# EAGLE board Test (EAGLE 7.3.0)
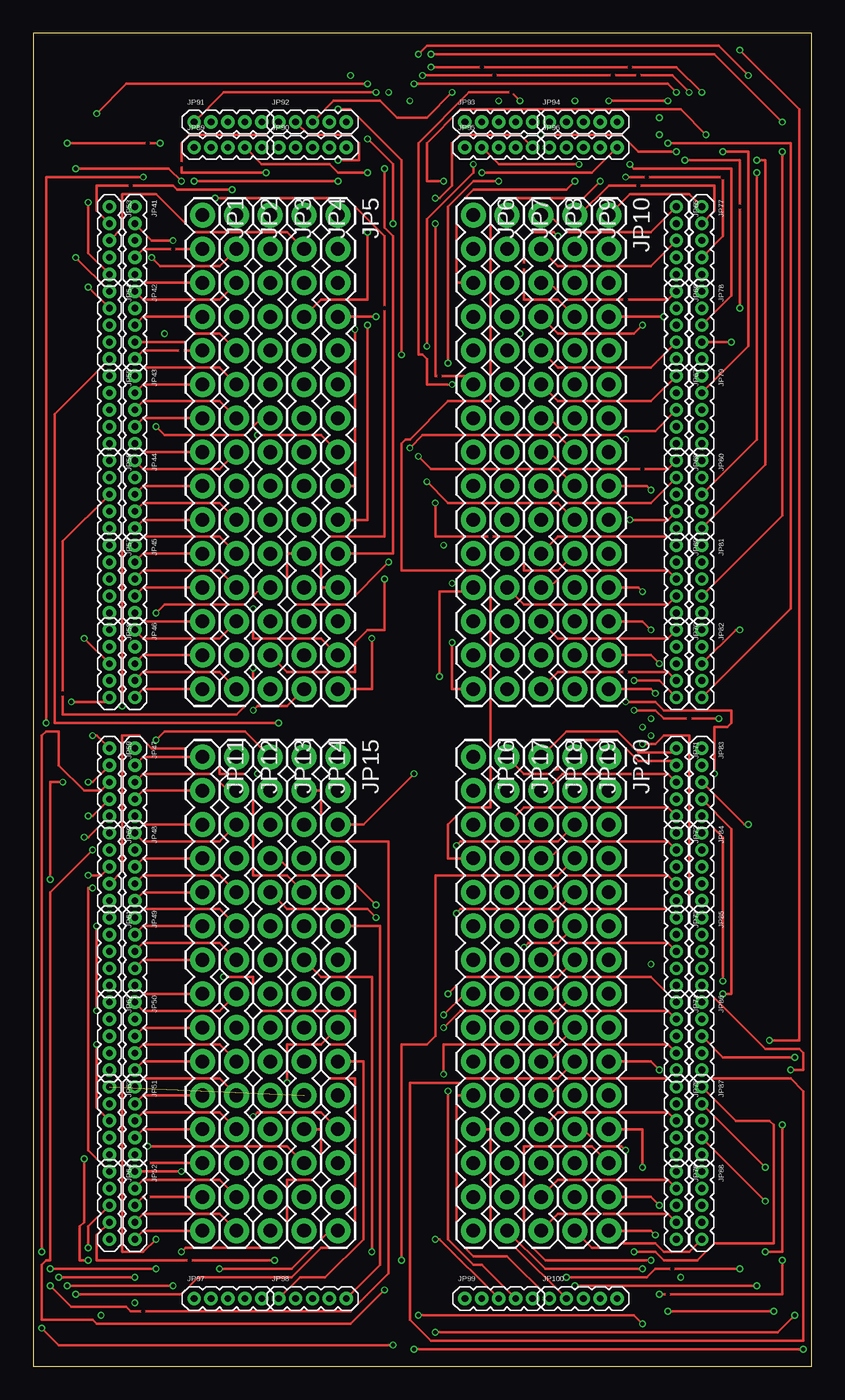
[diagram p2: board, top side]
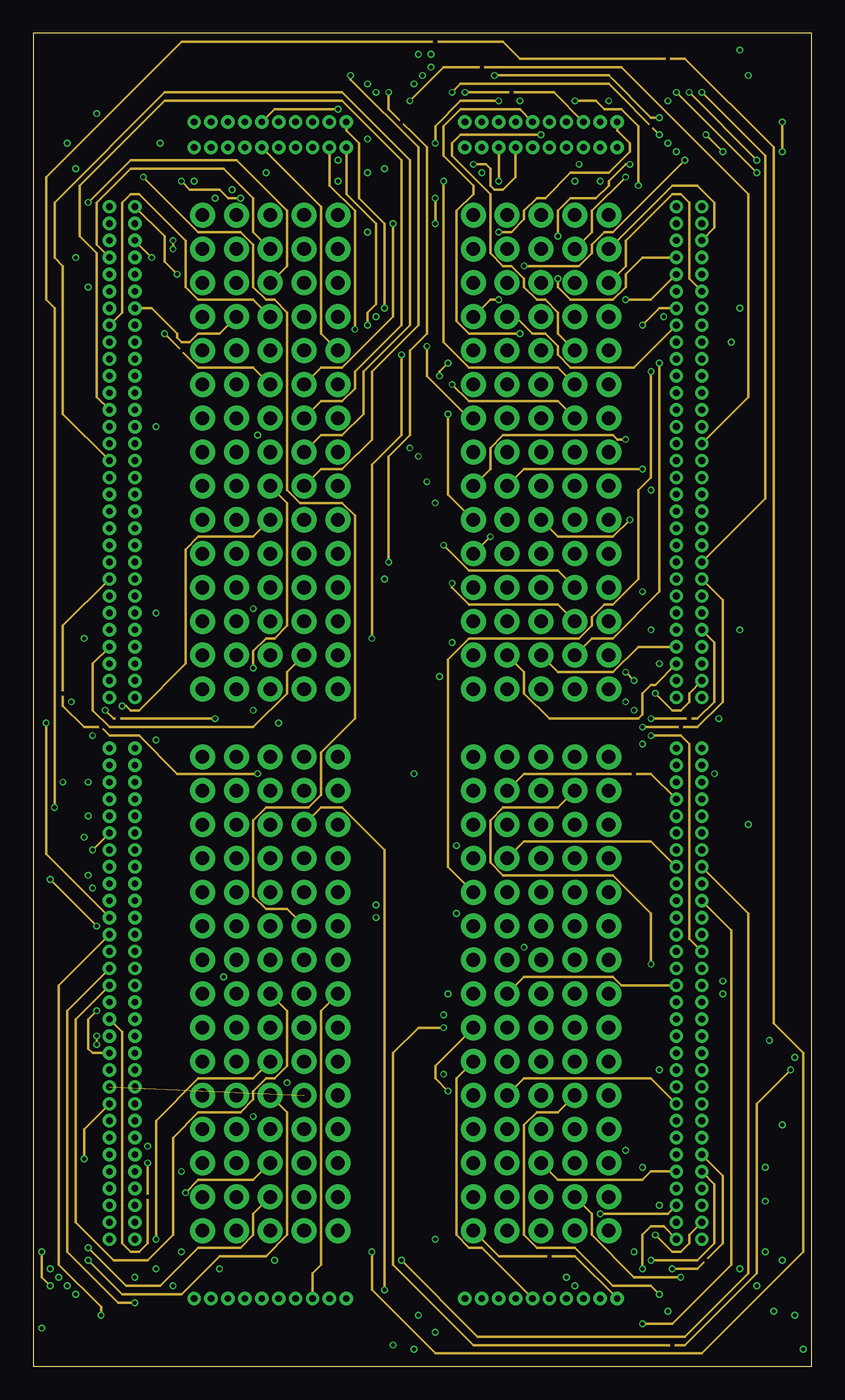
[diagram p3: board, inner layer Route2]
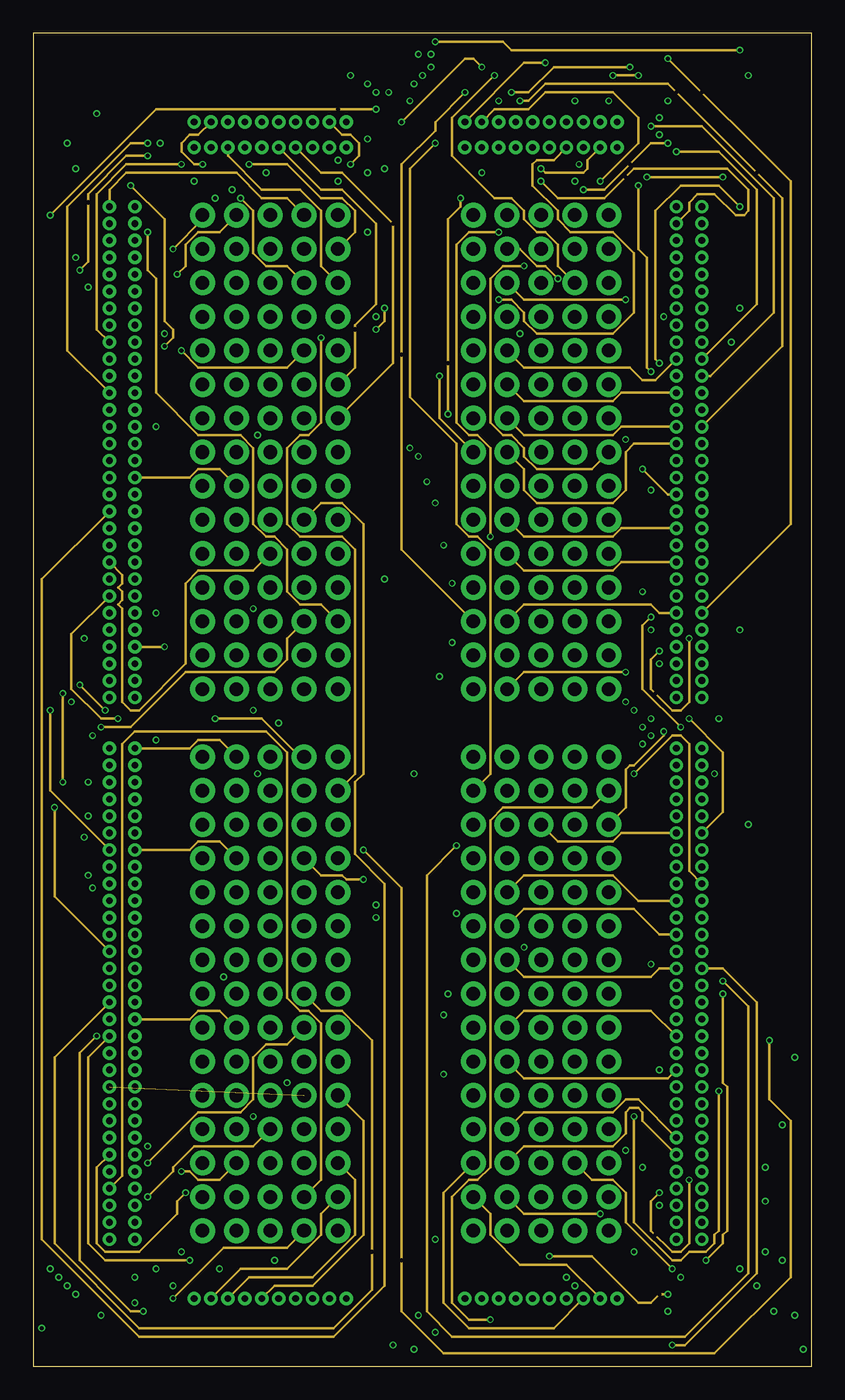
[diagram p4: board, inner layer Route15]
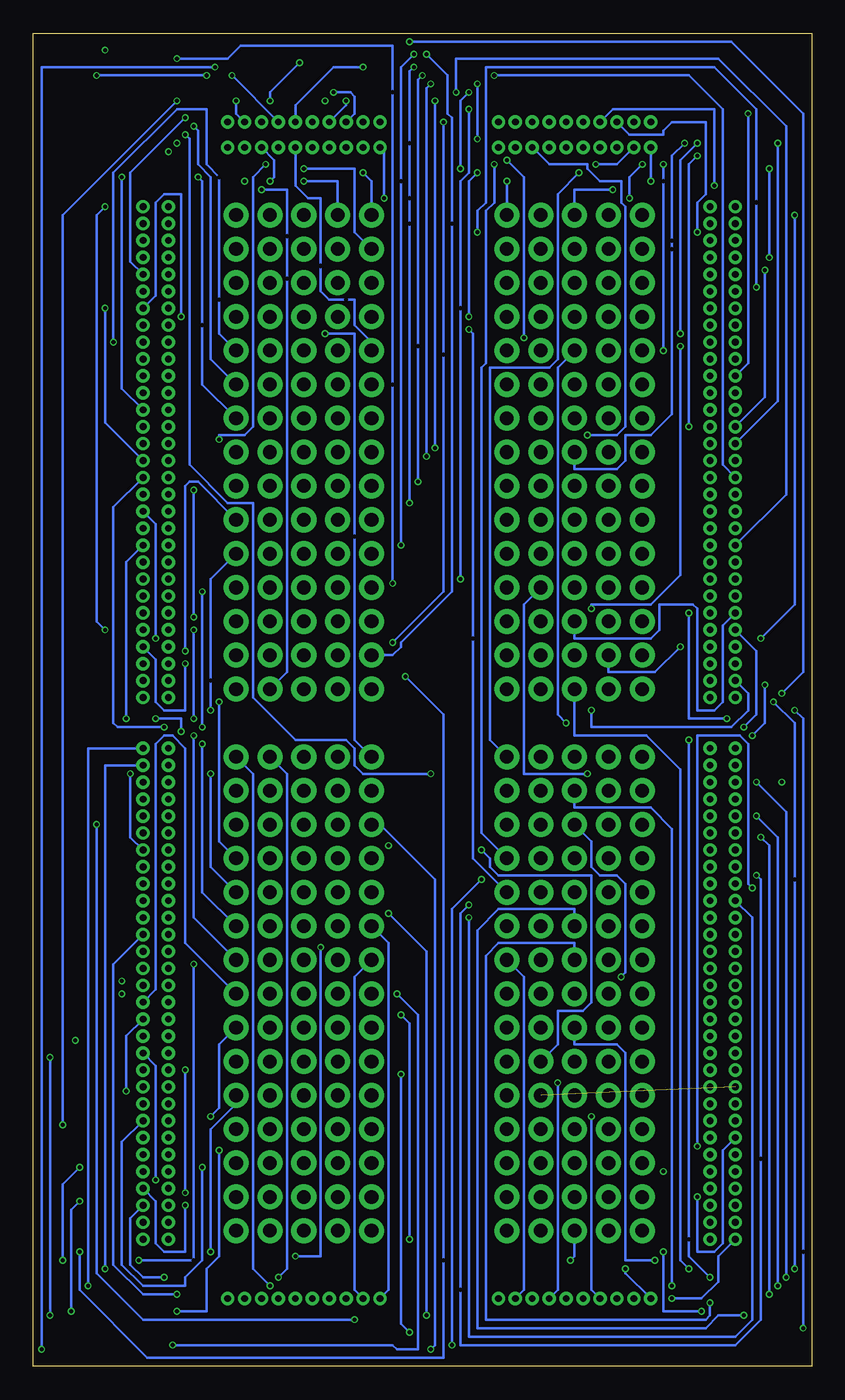
[diagram p5: board, bottom side, seen from below]

Size 58.4 x 100 mm. Coordinates in mm from the lower left corner, seen from the top.
Outline: 0,0 58.4,0 58.4,100 0,100 0,0
Copper layers [2:(1*(2*15)*16):15]: Top 0.035mm / dielectric 0.2mm / Route2 0.0175mm / dielectric 0.3mm / Route15 0.0175mm / dielectric 0.2mm / Bottom 0.035mm
Design rules "SeeedStudio_4layer_DRU_no_angle_20140221 *": minimum track width 8mil, minimum drill 12mil, track to track 8mil, track to pad 8mil, pad to pad 8mil, via to via 8mil, smd to smd 0mil, copper to edge 10mil, drill to drill 8mil, minimum pad ring 6mil, minimum via ring 4mil, stop-mask expansion 4mil, vias tented up to drill 100mil, thermal gap 10mil

## Footprints (pad centres in the part's own frame; a part is rotated, then mirrored left to right if it is on the bottom)
1X15 = drill 1.016 pad 1.88: 1 0,0; 2 2.54,0; 3 5.08,0; 4 7.62,0; 5 10.16,0; 6 12.7,0; 7 15.24,0; 8 17.78,0; 9 20.32,0; 10 22.86,0; 11 25.4,0; 12 27.94,0; 13 30.48,0; 14 33.02,0; 15 35.56,0
1X05-1.27MM = drill 0.508 pad 1: 1 0,0; 2 1.27,0; 3 2.54,0; 4 3.81,0; 5 5.08,0

## Placement (x,y rotation side)
JP1  [1X15]  12.7,86.36 270 top
JP2  [1X15]  15.24,86.36 270 top
JP3  [1X15]  17.78,86.36 270 top
JP4  [1X15]  20.32,86.36 270 top
JP5  [1X15]  22.86,86.36 270 top
JP6  [1X15]  33.02,86.36 270 top
JP7  [1X15]  35.56,86.36 270 top
JP8  [1X15]  38.1,86.36 270 top
JP9  [1X15]  40.64,86.36 270 top
JP10  [1X15]  43.18,86.36 270 top
JP11  [1X15]  12.7,45.72 270 top
JP12  [1X15]  15.24,45.72 270 top
JP13  [1X15]  17.78,45.72 270 top
JP14  [1X15]  20.32,45.72 270 top
JP15  [1X15]  22.86,45.72 270 top
JP16  [1X15]  33.02,45.72 270 top
JP17  [1X15]  35.56,45.72 270 top
JP18  [1X15]  38.1,45.72 270 top
JP19  [1X15]  40.64,45.72 270 top
JP20  [1X15]  43.18,45.72 270 top
JP41  [1X05-1.27MM]  7.62,87 270 top
JP42  [1X05-1.27MM]  7.62,80.64 270 top
JP43  [1X05-1.27MM]  7.62,74.3 270 top
JP44  [1X05-1.27MM]  7.62,67.94 270 top
JP45  [1X05-1.27MM]  7.62,61.59 270 top
JP46  [1X05-1.27MM]  7.62,55.24 270 top
JP47  [1X05-1.27MM]  7.62,46.35 270 top
JP48  [1X05-1.27MM]  7.62,40.01 270 top
JP49  [1X05-1.27MM]  7.62,33.66 270 top
JP50  [1X05-1.27MM]  7.62,27.3 270 top
JP51  [1X05-1.27MM]  7.62,20.95 270 top
JP52  [1X05-1.27MM]  7.62,14.61 270 top
JP53  [1X05-1.27MM]  5.71,87 270 top
JP54  [1X05-1.27MM]  5.71,80.64 270 top
JP55  [1X05-1.27MM]  5.71,74.3 270 top
JP56  [1X05-1.27MM]  5.71,67.94 270 top
JP57  [1X05-1.27MM]  5.71,61.59 270 top
JP58  [1X05-1.27MM]  5.71,55.24 270 top
JP59  [1X05-1.27MM]  5.71,46.35 270 top
JP60  [1X05-1.27MM]  5.71,40.01 270 top
JP61  [1X05-1.27MM]  5.71,33.66 270 top
JP62  [1X05-1.27MM]  5.71,27.3 270 top
JP63  [1X05-1.27MM]  5.71,20.95 270 top
JP64  [1X05-1.27MM]  5.71,14.61 270 top
JP65  [1X05-1.27MM]  48.26,87 270 top
JP66  [1X05-1.27MM]  48.26,80.64 270 top
JP67  [1X05-1.27MM]  48.26,74.3 270 top
JP68  [1X05-1.27MM]  48.26,67.94 270 top
JP69  [1X05-1.27MM]  48.26,61.59 270 top
JP70  [1X05-1.27MM]  48.26,55.24 270 top
JP71  [1X05-1.27MM]  48.26,46.35 270 top
JP72  [1X05-1.27MM]  48.26,40.01 270 top
JP73  [1X05-1.27MM]  48.26,33.66 270 top
JP74  [1X05-1.27MM]  48.26,27.3 270 top
JP75  [1X05-1.27MM]  48.26,20.95 270 top
JP76  [1X05-1.27MM]  48.26,14.61 270 top
JP77  [1X05-1.27MM]  50.16,87 270 top
JP78  [1X05-1.27MM]  50.16,80.64 270 top
JP79  [1X05-1.27MM]  50.16,74.3 270 top
JP80  [1X05-1.27MM]  50.16,67.94 270 top
JP81  [1X05-1.27MM]  50.16,61.59 270 top
JP82  [1X05-1.27MM]  50.16,55.24 270 top
JP83  [1X05-1.27MM]  50.16,46.35 270 top
JP84  [1X05-1.27MM]  50.16,40.01 270 top
JP85  [1X05-1.27MM]  50.16,33.66 270 top
JP86  [1X05-1.27MM]  50.16,27.3 270 top
JP87  [1X05-1.27MM]  50.16,20.95 270 top
JP88  [1X05-1.27MM]  50.16,14.61 270 top
JP89  [1X05-1.27MM]  12.06,91.44 0 top
JP90  [1X05-1.27MM]  18.41,91.44 0 top
JP91  [1X05-1.27MM]  12.06,93.34 0 top
JP92  [1X05-1.27MM]  18.41,93.34 0 top
JP93  [1X05-1.27MM]  32.38,93.34 0 top
JP94  [1X05-1.27MM]  38.73,93.34 0 top
JP95  [1X05-1.27MM]  32.38,91.44 0 top
JP96  [1X05-1.27MM]  38.73,91.44 0 top
JP97  [1X05-1.27MM]  12.06,5.08 0 top
JP98  [1X05-1.27MM]  18.41,5.08 0 top
JP99  [1X05-1.27MM]  32.38,5.08 0 top
JP100  [1X05-1.27MM]  38.73,5.08 0 top

## Tracks (layer width: path | path; a pad name or v marks a point on that pad's centre or on a via)
NEW_0  (via drill 0.3 layers 2-15)
  Route2 0.203: JP65.5 46.35,80.01 v44.45,80.01
  Route15 0.203: v44.45,80.01 36.83,80.01 JP7.3
NEW_1  (via drill 0.3 layers 2-15)
  Route2 0.203: JP65.4 45.72,83.19 44.45,81.92 44.45,80.96 43.5,80.01 40.32,80.01 39.37,80.96 v39.37,81.6
  Route15 0.203: v39.37,81.6 38.42,82.55 37.78,82.55 36.51,83.82 JP7.2
NEW_2
  Top 0.203: JP65.3 46.35,82.55 39.37,82.55 JP8.2
NEW_3  (via drill 0.3 layers 15-16)
  Route15 0.203: JP65.2 49.21,86.68 49.21,87.31 49.85,87.95 51.12,87.95 52.7,86.36 53.34,86.36 53.66,86.68 53.66,88.27 52.07,89.85 45.09,89.85 42.86,87.63 39.37,87.63 v38.1,88.9
  Bottom 0.203: v38.1,88.9 35.56,88.9 JP7.1
NEW_4
  Top 0.203: JP65.1 46.35,85.09 40.01,85.09 38.73,86.36 JP8.1
NEW_5
  Route15 0.203: JP66.5 46.67,73.98 45.72,73.98 44.77,74.93 36.83,74.93 JP7.5
NEW_6
  Top 0.203: JP66.4 46.35,74.93 39.37,74.93 JP8.5
NEW_7
  Route2 0.203: JP66.3 45.09,74.93 40.32,74.93 39.37,75.88 39.37,76.52 38.42,77.47 37.47,77.47 36.2,78.74 JP7.4
NEW_8  (via drill 0.3 layers 1-2)
  Top 0.203: v45.72,78.11 45.09,77.47 39.37,77.47 JP8.4
  Route2 0.203: JP66.2 46.99,79.38 v45.72,78.11
NEW_9
  Top 0.203: JP66.1 47.62,80.01 40.01,80.01 38.73,81.28 JP8.3
NEW_10
  Route15 0.203: JP67.5 45.09,69.22 44.45,68.58 44.45,65.72 43.5,64.77 37.78,64.77 36.83,65.72 36.83,67.31 JP7.8
NEW_11
  Route15 0.203: JP67.4 44.13,70.48 43.5,69.85 36.83,69.85 JP7.7
NEW_12
  Top 0.203: JP67.3 46.67,70.17 44.13,70.17 43.81,69.85 40.01,69.85 38.73,71.12 JP8.7
NEW_13
  Route15 0.203: JP67.2 44.13,73.03 43.5,72.39 36.83,72.39 JP7.6
NEW_14
  Top 0.203: JP67.1 46.35,72.39 39.37,72.39 JP8.6
NEW_15
  Route15 0.203: JP68.5 44.13,62.87 43.5,62.23 36.83,62.23 JP7.10
NEW_16  (via drill 0.3 layers 1-2)
  Top 0.203: JP68.4 47.62,63.5 v44.77,63.5
  Route2 0.203: v44.77,63.5 43.5,62.23 39.37,62.23 JP8.10
NEW_17  (via drill 0.3 layers 2-15)
  Route2 0.203: v45.72,67.31 36.83,67.31 JP7.9
  Route15 0.203: JP68.3 47.62,65.41 v45.72,67.31
NEW_18
  Top 0.203: JP68.2 46.35,64.77 40.01,64.77 38.73,66.04 JP8.9
NEW_19
  Top 0.203: JP68.1 47.62,67.31 40.01,67.31 38.73,68.58 JP8.8
NEW_20
  Route15 0.203: JP69.5 46.99,56.52 46.35,57.15 36.83,57.15 JP7.13
NEW_21
  Top 0.203: JP69.4 47.62,57.15 36.83,57.15 JP7.12
NEW_22
  Top 0.203: JP69.3 47.62,59.69 40.01,59.69 38.73,58.42 JP8.12
NEW_23
  Route15 0.203: JP69.2 44.13,60.33 43.5,59.69 36.83,59.69 JP7.11
NEW_24
  Top 0.203: JP69.1 47.62,62.23 39.37,62.23 JP8.11
NEW_25  (via drill 0.3 layers 1-2, 0.3 layers 2-15)
  Top 0.203: JP70.5 46.99,51.44 v45.09,51.44
  Route2 0.203: v44.45,52.07 v45.09,51.44
  Route15 0.203: v44.45,52.07 36.83,52.07 JP7.15
NEW_26
  Top 0.203: JP70.4 47.62,52.07 39.37,52.07 JP8.15
NEW_27
  Route2 0.203: JP70.3 46.67,51.12 46.35,51.12 45.72,50.48 45.72,48.9 45.4,48.58 38.73,48.58 36.83,50.48 36.83,52.07 JP7.14
NEW_28
  Route2 0.203: JP70.2 45.4,53.98 43.5,52.07 39.37,52.07 JP8.14
NEW_29
  Top 0.203: JP70.1 47.62,54.61 39.37,54.61 JP8.13
NEW_30
  Top 0.203: JP71.5 47.62,41.91 36.83,41.91 JP17.3
NEW_31
  Route2 0.203: JP71.4 46.35,44.45 36.83,44.45 JP17.2
NEW_32
  Top 0.203: JP71.3 47.62,44.45 39.69,44.45 38.42,43.18 JP18.2
NEW_33
  Top 0.203: JP71.2 47.94,45.4 45.4,45.4 43.81,46.99 40.01,46.99 39.37,46.35 39.37,44.77 39.05,44.77 38.73,44.45 36.83,44.45 JP17.1
NEW_34
  Top 0.203: JP71.1 47.94,46.04 45.4,46.04 43.81,47.62 40.01,47.62 JP18.1
NEW_35
  Route15 0.203: JP72.5 45.4,34.92 43.5,36.83 36.83,36.83 JP17.5
NEW_36
  Top 0.203: JP72.4 47.62,36.83 40.01,36.83 38.73,35.56 JP18.5
NEW_37
  Route2 0.203: JP72.3 46.35,39.37 36.83,39.37 JP17.4
NEW_38
  Top 0.203: JP72.2 47.62,39.37 40.01,39.37 38.73,38.1 JP18.4
NEW_39
  Route15 0.203: JP72.1 44.13,40.01 43.5,39.37 39.37,39.37 JP18.3
NEW_40
  Route2 0.203: JP73.5 44.13,28.57 43.5,29.21 36.83,29.21 JP17.8
NEW_41
  Route15 0.203: JP73.4 46.99,29.84 46.35,29.21 36.83,29.21 JP17.7
NEW_42
  Top 0.203: JP73.3 47.62,31.75 40.01,31.75 38.73,30.48 JP18.7
NEW_43
  Route15 0.203: JP73.2 46.99,32.38 45.09,34.29 36.83,34.29 JP17.6
NEW_44
  Top 0.203: JP73.1 47.62,34.29 40.01,34.29 38.73,33.02 JP18.6
NEW_45
  Route15 0.203: JP74.5 47.62,21.59 36.83,21.59 JP17.10
NEW_46
  Top 0.203: JP74.4 47.62,24.13 40.01,24.13 38.73,22.86 JP18.10
NEW_47
  Route15 0.203: JP74.3 46.35,26.67 36.83,26.67 JP17.9
NEW_48
  Top 0.203: JP74.2 47.62,26.67 40.01,26.67 38.73,25.4 JP18.9
NEW_49
  Top 0.203: JP74.1 46.35,29.21 40.01,29.21 38.73,27.94 JP18.8
NEW_50
  Route15 0.203: JP75.5 45.72,18.41 45.72,19.05 45.4,19.37 44.77,19.37 44.45,19.05 44.45,17.46 43.5,16.51 36.83,16.51 JP17.13
NEW_51
  Route15 0.203: JP75.4 45.4,20 44.45,20 43.5,19.05 36.83,19.05 JP17.12
NEW_52
  Top 0.203: JP75.3 47.62,19.05 39.37,19.05 JP18.12
NEW_53
  Route2 0.203: JP75.2 46.35,21.59 36.83,21.59 JP17.11
NEW_54
  Top 0.203: JP75.1 47.62,21.59 40.01,21.59 38.73,20.32 JP18.11
NEW_55  (via drill 0.3 layers 1-2)
  Top 0.203: v45.72,7.3 38.42,7.3 JP17.15
  Route2 0.203: JP76.5 47.31,10.48 46.35,10.48 45.72,9.84 v45.72,7.3
NEW_56
  Top 0.203: JP76.4 47.62,11.43 39.37,11.43 JP18.15
NEW_57  (via drill 0.3 layers 2-15)
  Route2 0.203: JP76.3 47.62,11.43 v42.55,11.43
  Route15 0.203: v42.55,11.43 36.83,11.43 JP17.14
NEW_58
  Top 0.203: JP76.2 47.62,13.97 39.37,13.97 JP18.14
NEW_59
  Route2 0.203: JP76.1 46.35,14.61 45.72,13.97 39.37,13.97 JP18.13
NEW_60  (via drill 0.3, 0.3 layers 2-15)
  Route2 0.203: v46.99,93.66 46.35,93.66 43.18,96.84 v34.61,96.84
  Route15 0.203: v34.61,96.84 31.43,93.66 31.43,90.81 34.61,87.63 35.88,87.63 36.83,86.68 36.83,86.04 37.78,85.09 38.42,85.09 39.37,84.14 39.37,82.55 JP9.3
  Bottom 0.203: JP77.5 51.12,82.87 51.12,89.53 v46.99,93.66
NEW_61  (via drill 0.3 layers 1-2)
  Top 0.203: JP77.4 51.75,84.77 51.75,89.22 v44.45,89.22
  Route2 0.203: v44.45,89.22 41.91,86.68 41.91,85.09 JP9.2
NEW_62
  Route2 0.203: JP77.3 51.12,85.41 51.12,87.31 49.85,88.58 47.94,88.58 JP10.2
NEW_63
  Top 0.203: JP77.2 51.12,86.68 51.12,88.58 43.18,88.58 40.96,86.36 JP9.1
NEW_64
  Top 0.203: JP77.1 49.21,87.95 44.77,87.95 JP10.1
NEW_65  (via drill 0.3, 0.3 layers 1-2)
  Top 0.203: v48.26,91.12 45.4,91.12 44.13,92.39 v38.1,92.39
  Route2 0.203: v38.1,92.39 32.07,92.39 31.43,91.76 31.43,90.81 34.29,87.95 34.29,83.5 35.24,82.55 35.88,82.55 36.83,81.6 36.83,80.96 37.78,80.01 38.42,80.01 39.37,79.06 39.37,77.47 JP9.5
  Route15 0.203: JP78.5 54.29,79.69 54.29,88.27 51.44,91.12 v48.26,91.12
NEW_66  (via drill 0.3)
  Top 0.203: v52.39,76.83 JP78.4
  Bottom 0.203: v52.39,76.83 52.39,89.53 47.62,94.3 45.4,94.3 45.4,90.17 44.45,89.22 44.45,77.47 JP10.5
NEW_67  (via drill 0.3 layers 1-2)
  Top 0.203: JP78.3 52.39,80.33 52.39,89.85 45.09,89.85 v44.77,90.17 | v39.37,84.77 39.05,85.09 37.47,85.09 36.83,84.45 36.83,80.01 39.37,80.01 JP9.4
  Route2 0.203: v44.77,90.17 44.45,90.17 43.18,88.9 43.18,88.58 42.23,87.63 40.32,87.63 39.37,86.68 v39.37,84.77
NEW_68  (via drill 0.3)
  Top 0.203: JP10.4 v47.31,78.74
  Bottom 0.203: JP78.2 49.21,80.33 49.21,87.31 48.58,87.95 47.31,87.95 v47.31,78.74
NEW_69
  Route2 0.203: JP78.1 49.21,81.6 49.21,87.31 48.58,87.95 47.94,87.95 44.45,84.45 44.45,82.55 JP10.3
NEW_70  (via drill 0.3)
  Top 0.203: v28.26,68.9 29.21,69.85 39.37,69.85 JP9.8
  Route2 0.203: JP79.5 53.66,72.71 53.66,87.95 44.13,97.47 30.8,97.47 v28.26,94.93
  Bottom 0.203: v28.26,68.9 v28.26,94.93
NEW_71  (via drill 0.3, 0.3 layers 1-2)
  Top 0.203: v36.51,94.93 35.88,95.57 32.7,95.57 28.89,91.76 28.89,75.88 29.21,75.88 29.53,75.56 29.53,73.66 v31.43,73.66
  Route2 0.203: v31.43,73.66 32.7,72.39 39.37,72.39 JP9.7
  Route15 0.203: JP79.4 56.2,76.52 56.2,87.63 47.62,96.2 38.42,96.2 37.15,94.93 v36.51,94.93
NEW_72  (via drill 0.3 layers 15-16)
  Route15 0.203: v46.04,89.22 v51.75,89.22
  Bottom 0.203: JP79.3 51.75,73.34 v51.75,89.22 | v46.04,89.22 45.72,88.9 45.72,73.66 JP10.7
NEW_73  (via drill 0.3 layers 1-2)
  Top 0.203: JP79.2 53.66,76.52 53.66,91.12 v51.75,91.12 | v50.48,92.39 48.58,94.3 32.07,94.3 29.53,91.76 29.53,88.9 v30.8,88.9
  Route2 0.203: v50.48,92.39 v51.75,91.12 | v30.8,88.9 30.8,76.83 32.7,74.93 39.37,74.93 JP9.6
NEW_74  (via drill 0.3 layers 15-16)
  Route15 0.203: JP79.1 50.8,74.3 55.56,79.06 55.56,87.63 50.16,93.03 v46.35,93.03
  Bottom 0.203: v46.35,93.03 46.04,92.71 46.04,90.17 45.09,89.22 45.09,75.56 JP10.6
NEW_75  (via drill 0.3, 0.3 layers 1-2)
  Top 0.203: JP80.5 54.93,67.63 54.93,90.49 v54.29,90.49 | v49.21,95.57 47.94,96.84 v29.21,96.84 | v29.53,66.36 31.11,64.77 39.37,64.77 JP9.10
  Route2 0.203: v49.21,95.57 v54.29,90.49
  Bottom 0.203: v29.21,96.84 29.53,96.52 v29.53,66.36
NEW_76  (via drill 0.3 layers 15-16)
  Route15 0.203: v49.21,54.61 49.21,49.85 48.58,49.21 47.94,49.21 46.35,50.8 46.35,53.02 v46.99,53.66
  Bottom 0.203: JP80.4 49.21,63.18 v49.21,54.61 | v46.99,53.66 46.99,66.04 46.67,66.36 46.04,66.36 JP10.10
NEW_77  (via drill 0.3, 0.3 layers 1-2)
  Top 0.203: JP80.3 54.29,69.53 v54.29,89.53 | v48.26,95.57 47.62,96.2 v28.57,96.2 | v28.89,68.26 29.84,67.31 39.37,67.31 JP9.9
  Route2 0.203: v48.26,95.57 v54.29,89.53
  Bottom 0.203: v28.57,96.2 28.89,95.89 v28.89,68.26
NEW_78  (via drill 0.3, 0.3 layers 15-16)
  Top 0.203: v46.35,65.72 46.04,66.04 JP10.9
  Route15 0.203: v48.58,47.94 45.72,50.8 45.72,55.56 v46.35,56.2
  Bottom 0.203: JP80.2 52.39,64.45 52.39,48.26 52.07,47.94 v48.58,47.94 | v46.35,65.72 v46.35,56.2
NEW_79  (via drill 0.3, 0.3 layers 1-2, 0.3 layers 2-15)
  Top 0.203: v53.02,79.38 53.02,90.49 v48.9,90.49
  Route2 0.203: v48.9,90.49 43.5,85.09 42.86,85.09 41.91,84.14 41.91,83.5 40.96,82.55 v36.83,82.55
  Route15 0.203: v36.83,82.55 35.24,82.55 34.29,81.6 34.29,70.8 35.24,69.85 35.88,69.85 36.83,68.9 36.83,68.26 37.78,67.31 41.91,67.31 JP10.8
  Bottom 0.203: JP80.1 53.02,70.8 v53.02,79.38
NEW_80  (via drill 0.3, 0.3 layers 15-16)
  Route2 0.203: v31.43,58.74 31.43,58.42 32.7,57.15 39.37,57.15 JP9.13
  Route15 0.203: JP81.5 56.83,63.18 56.83,88.9 v47.62,98.11
  Bottom 0.203: v47.62,98.11 43.81,98.11 42.86,99.06 31.43,99.06 v31.43,58.74
NEW_81  (via drill 0.3, 0.3 layers 1-2)
  Top 0.203: JP81.4 56.2,63.82 v56.2,91.12 | v56.2,93.34 51.12,98.42 v29.84,98.42
  Route2 0.203: v56.2,93.34 v56.2,91.12 | v30.8,61.59 32.7,59.69 39.37,59.69 JP9.12
  Bottom 0.203: v29.84,98.42 30.8,97.47 v30.8,61.59
NEW_82  (via drill 0.3)
  Top 0.203: v45.72,58.1 45.4,58.42 JP10.12
  Route2 0.203: JP81.3 51.75,57.47 51.75,49.85 49.85,47.94 v45.72,47.94
  Bottom 0.203: v45.72,58.1 v45.72,47.94
NEW_83  (via drill 0.3, 0.3 layers 1-2)
  Top 0.203: v50.16,95.57 48.26,97.47 v29.84,97.47 | v30.16,64.77 30.16,62.23 36.2,62.23 36.83,61.59 36.83,59.69 39.37,59.69 JP9.11
  Route2 0.203: JP81.2 54.93,65.09 54.93,90.81 v50.16,95.57
  Bottom 0.203: v29.84,97.47 30.16,97.16 v30.16,64.77
NEW_84  (via drill 0.3)
  Top 0.203: v51.44,48.58 47.31,48.58 46.67,49.21 v45.09,49.21
  Bottom 0.203: JP81.1 51.44,60.33 v51.44,48.58 | v45.09,49.21 45.09,59.05 JP10.11
NEW_85  (via drill 0.3, 0.3 layers 15-16)
  Top 0.203: JP82.5 56.83,56.83 56.83,91.76 v47.62,91.76
  Route15 0.203: v47.62,91.76 46.35,91.76 42.86,88.27 v41.27,88.27
  Bottom 0.203: v41.27,88.27 39.37,88.27 39.37,52.07 JP9.15
NEW_86  (via drill 0.3 layers 1-2)
  Top 0.203: v46.67,50.48 46.35,50.8 JP10.15
  Route2 0.203: JP82.4 49.21,50.48 49.21,49.85 48.58,49.21 47.94,49.21 v46.67,50.48
NEW_87  (via drill 0.3, 0.3 layers 15-16, 0.3 layers 2-15)
  Top 0.203: JP82.3 52.7,55.24 v53.02,55.24
  Route2 0.203: v46.99,75.25 46.99,58.1 43.5,54.61 41.91,54.61 JP9.14
  Route15 0.203: v53.02,87 51.44,88.58 48.58,88.58 46.67,86.68 46.67,75.56 v46.99,75.25
  Bottom 0.203: v53.02,55.24 53.66,55.88 53.66,86.36 v53.02,87
NEW_88  (via drill 0.3)
  Top 0.203: v46.99,52.7 46.35,53.34 JP10.14
  Bottom 0.203: JP82.2 49.21,53.02 49.21,49.85 48.58,49.21 46.99,49.21 v46.99,52.7
NEW_89  (via drill 0.3)
  Top 0.203: v46.35,55.24 45.72,55.88 JP10.13
  Route2 0.203: JP82.1 51.12,54.29 51.12,49.85 49.85,48.58 v46.35,48.58
  Bottom 0.203: v46.35,55.24 v46.35,48.58
NEW_90  (via drill 0.3)
  Top 0.203: JP83.5 51.75,39.69 v51.75,28.89 | v31.75,39.05 32.07,39.37 39.37,39.37 JP19.3
  Route15 0.203: v51.75,28.89 53.66,26.99 53.66,6.99 48.9,2.22 31.43,2.22 29.53,4.13 29.53,36.83 v31.75,39.05
NEW_91  (via drill 0.3, 0.3 layers 15-16)
  Top 0.203: JP83.4 52.39,40.32 52.39,27.94 v51.75,27.94
  Route2 0.203: v46.35,30.16 46.35,33.97 43.5,36.83 35.24,36.83 34.29,37.78 34.29,40.96 35.24,41.91 39.37,41.91 JP19.2
  Route15 0.203: v51.75,27.94 51.75,21.27 52.07,20.95 52.07,10.16 51.75,9.84 51.75,9.21 v50.48,7.94
  Bottom 0.203: v50.48,7.94 46.35,7.94 v46.35,30.16
NEW_92  (via drill 0.3, 0.3 layers 15-16)
  Top 0.203: JP83.3 53.34,40.64 v53.66,40.64
  Route15 0.203: v34.29,3.49 32.7,3.49 31.43,4.76 31.43,12.7 32.7,13.97 33.34,13.97 34.29,14.92 34.29,40.96 35.24,41.91 41.91,41.91 JP20.2
  Bottom 0.203: v53.66,40.64 53.66,6.99 50.16,3.49 v34.29,3.49
NEW_93  (via drill 0.3)
  Top 0.203: v53.02,7.3 46.67,7.3 46.04,6.67 v40.01,6.67
  Bottom 0.203: JP83.2 53.02,45.09 v53.02,7.3 | v40.01,6.67 39.37,7.3 39.37,44.45 JP19.1
NEW_94  (via drill 0.3)
  Top 0.203: v40.64,6.03 v54.29,6.03
  Bottom 0.203: JP83.1 54.29,46.35 v54.29,6.03 | v40.64,6.03 41.91,7.3 41.91,44.45 JP20.1
NEW_95  (via drill 0.3, 0.3 layers 1-2)
  Top 0.203: v45.72,3.17 45.09,3.81 v28.89,3.81 | v31.75,33.97 32.07,34.29 39.37,34.29 JP19.5
  Route2 0.203: JP84.5 52.39,32.7 52.39,7.62 47.94,3.17 v45.72,3.17
  Bottom 0.203: v28.89,3.81 28.89,31.11 v31.75,33.97
NEW_96  (via drill 0.3 layers 15-16)
  Route15 0.203: JP84.4 49.21,37.15 49.21,46.67 48.58,47.31 47.94,47.31 v45.09,44.45
  Bottom 0.203: v45.09,44.45 45.09,37.47 JP20.5
NEW_97  (via drill 0.3 layers 1-2)
  Top 0.203: v27.62,7.94 27.62,24.13 29.53,24.13 30.16,24.77 30.16,36.83 39.37,36.83 JP19.4
  Route2 0.203: JP84.3 53.66,33.97 53.66,6.99 48.9,2.22 33.34,2.22 v27.62,7.94
NEW_98  (via drill 0.3)
  Top 0.203: v51.12,44.45 51.12,47.94 52.07,47.94 52.39,48.26 52.39,49.21 47.31,49.21 46.67,49.85 v44.45,49.85
  Bottom 0.203: JP84.2 51.12,39.69 v51.12,44.45 | v44.45,49.85 44.45,39.37 JP20.4
NEW_99  (via drill 0.3 layers 15-16)
  Route15 0.203: JP84.1 51.75,41.59 51.75,46.04 v49.21,48.58 | v47.31,47.62 47.31,47.31 45.09,45.09 44.77,45.09 44.45,44.77 44.45,41.91 JP20.3
  Bottom 0.203: v49.21,48.58 47.31,48.58 v47.31,47.62
NEW_100  (via drill 0.3 layers 1-2)
  Top 0.203: JP85.5 54.93,23.81 57.47,23.81 57.78,23.5 57.78,22.23 v56.83,22.23 | v30.8,25.4 32.07,26.67 39.37,26.67 JP19.8
  Route2 0.203: v56.83,22.23 54.29,19.68 54.29,6.99 48.9,1.59 33.02,1.59 26.99,7.62 26.99,23.5 28.89,25.4 v30.8,25.4
NEW_101  (via drill 0.3, 0.3 layers 15-16)
  Top 0.203: v31.11,27.94 32.38,29.21 39.37,29.21 JP19.7
  Route15 0.203: JP85.4 51.75,29.84 54.29,27.3 54.29,6.99 48.9,1.59 v47.94,1.59
  Bottom 0.203: v47.94,1.59 31.43,1.59 31.11,1.27 29.53,1.27 29.53,26.35 v31.11,27.94
NEW_102  (via drill 0.3)
  Route2 0.203: JP85.3 49.21,32.07 49.21,46.67 48.58,47.31 v46.35,47.31
  Bottom 0.203: v46.35,47.31 46.35,33.66 JP20.7
NEW_103  (via drill 0.3, 0.3 layers 15-16)
  Top 0.203: v36.83,31.43 37.15,31.75 39.37,31.75 JP19.6
  Route15 0.203: v47.62,5.4 46.99,5.4 46.35,4.76 45.4,4.76 41.91,8.26 v38.73,8.26
  Bottom 0.203: JP85.2 52.39,30.16 52.39,7.62 50.16,5.4 v47.62,5.4 | v38.73,8.26 36.83,8.26 v36.83,31.43
NEW_104  (via drill 0.3)
  Top 0.203: JP85.1 49.21,34.61 49.21,47.31 47.31,47.31 46.67,46.67 v45.72,46.67
  Bottom 0.203: v45.72,46.67 45.72,35.56 JP20.6
NEW_105
  Top 0.203: JP86.5 50.8,21.59 56.83,21.59 57.78,20.64 57.78,1.91 29.84,1.91 28.26,3.49 28.26,21.27 32.07,21.27 32.38,21.59 39.37,21.59 JP19.10
NEW_106  (via drill 0.3, 0.3 layers 15-16)
  Top 0.203: v46.99,22.23 46.35,22.86 JP20.10
  Route15 0.203: v49.21,13.97 49.21,9.21 48.58,8.57 47.94,8.57 46.35,10.16 46.35,12.38 v46.99,13.02
  Bottom 0.203: JP86.4 49.21,22.54 v49.21,13.97 | v46.99,22.23 v46.99,13.02
NEW_107  (via drill 0.3)
  Top 0.203: JP86.3 51.75,23.18 v57.15,23.18 | v57.15,3.81 55.88,2.54 v30.16,2.54 | v30.8,21.91 30.8,24.13 39.37,24.13 JP19.9
  Bottom 0.203: v57.15,3.81 v57.15,23.18 | v30.16,2.54 30.8,3.17 v30.8,21.91
NEW_108  (via drill 0.3 layers 15-16)
  Route15 0.203: v51.44,20.64 51.44,10.16 51.12,9.84 51.12,9.21 50.48,8.57 49.21,8.57 48.58,7.94 47.94,7.94 45.09,10.79 v45.09,18.73
  Bottom 0.203: JP86.2 51.44,24.77 v51.44,20.64 | v45.09,18.73 44.45,19.37 44.45,24.13 JP20.9
NEW_109
  Bottom 0.203: JP86.1 49.21,28.26 49.21,46.67 48.58,47.31 47.94,47.31 46.99,46.35 46.99,31.75 JP20.8
NEW_110  (via drill 0.3 layers 2-15)
  Route2 0.203: JP87.5 51.75,14.29 51.75,9.21 49.85,7.3 v47.94,7.3
  Route15 0.203: v47.94,7.3 44.45,10.79 44.45,13.02 43.5,13.97 41.91,13.97 JP19.13
NEW_111  (via drill 0.3)
  Top 0.203: v54.93,12.38 JP87.4 | v47.62,4.13 v55.56,4.13 | v44.45,16.19 44.13,16.51 42.55,16.51 41.27,17.78 JP19.12
  Bottom 0.203: v54.93,12.38 55.56,11.75 v55.56,4.13 | v47.62,4.13 45.4,4.13 45.4,7.3 44.45,8.26 v44.45,16.19
NEW_112  (via drill 0.3)
  Top 0.203: v45.72,14.92 45.72,17.78 JP20.12
  Bottom 0.203: JP87.3 51.75,16.83 51.75,7.62 50.16,6.03 46.99,6.03 46.99,6.67 45.72,7.94 v45.72,14.92
NEW_113  (via drill 0.3, 0.3 layers 1-2)
  Top 0.203: v54.93,14.92 JP87.2 | v56.2,7.94 56.2,5.4 v46.99,5.4
  Route2 0.203: v46.99,5.4 46.35,6.03 43.5,6.03 40.64,8.89 37.78,8.89 36.83,9.84 36.83,18.1 37.78,19.05 39.37,19.05 JP19.11
  Bottom 0.203: v54.93,14.92 56.2,13.65 v56.2,7.94
NEW_114  (via drill 0.3)
  Top 0.203: JP87.1 52.7,18.41 55.24,18.41 55.56,18.1 55.56,9.21 51.12,9.21 49.85,7.94 47.31,7.94 46.67,8.57 v45.09,8.57
  Bottom 0.203: v45.09,8.57 45.09,17.78 43.18,19.68 JP20.11
NEW_115
  Top 0.203: JP88.5 49.21,8.57 47.31,8.57 46.67,9.21 44.13,9.21 43.81,8.89 41.91,8.89 JP19.15
NEW_116  (via drill 0.3 layers 1-2)
  Top 0.203: v46.67,9.84 46.35,10.16 JP20.15
  Route2 0.203: JP88.4 49.21,9.84 49.21,9.21 48.58,8.57 47.94,8.57 v46.67,9.84
NEW_117  (via drill 0.3)
  Route2 0.203: v48.58,6.67 45.09,6.67 41.91,9.84 41.91,11.43 JP19.14
  Bottom 0.203: JP88.3 51.12,11.11 51.12,7.62 50.16,6.67 v48.58,6.67
NEW_118  (via drill 0.3)
  Top 0.203: v46.99,12.06 46.35,12.7 JP20.14
  Bottom 0.203: JP88.2 49.21,12.38 49.21,9.21 48.58,8.57 46.99,8.57 v46.99,12.06
NEW_119  (via drill 0.3 layers 1-2)
  Top 0.203: v46.35,7.94 38.42,7.94 36.83,9.53 36.83,16.51 41.91,16.51 JP20.13
  Route2 0.203: JP88.1 51.12,13.65 51.12,9.21 49.85,7.94 v46.35,7.94
NEW_120
  Top 0.203: JP41.5 8.26,81.28 JP1.3
NEW_121
  Top 0.203: JP41.4 8.26,83.82 JP1.2
NEW_122  (via drill 0.3 layers 1-2)
  Top 0.203: v8.89,83.19 9.53,82.55 13.97,82.55 JP2.2
  Route2 0.203: v8.89,83.19 JP41.3
NEW_123  (via drill 0.3 layers 1-2, 0.3 layers 2-15)
  Top 0.203: JP41.2 8.89,84.45 v10.48,84.45
  Route2 0.203: v10.48,83.82 v10.48,84.45
  Route15 0.203: v10.48,83.82 12.7,86.04 JP1.1
NEW_124  (via drill 0.3 layers 2-15)
  Route2 0.203: JP41.1 9.84,84.77 9.84,82.87 v10.79,81.92
  Route15 0.203: v10.79,81.92 11.43,82.55 11.43,84.14 12.38,85.09 13.97,85.09 JP2.1
NEW_125
  Top 0.203: JP42.5 8.26,76.2 JP1.5
NEW_126
  Top 0.203: JP42.4 11.43,76.83 12.06,77.47 13.97,77.47 JP2.5
NEW_127
  Top 0.203: JP42.3 8.26,78.74 JP1.4
NEW_128
  Route2 0.203: JP42.2 8.89,79.38 10.79,77.47 10.79,77.15 11.11,76.83 11.75,76.83 12.38,77.47 13.97,77.47 JP2.4
NEW_129
  Top 0.203: JP42.1 8.26,80.01 13.97,80.01 JP2.3
NEW_130
  Top 0.203: JP43.5 8.26,68.58 JP1.8
NEW_131
  Top 0.203: JP43.4 8.26,71.12 JP1.7
NEW_132
  Top 0.203: JP43.3 8.26,72.39 13.97,72.39 JP2.7
NEW_133
  Top 0.203: JP43.2 8.26,73.66 JP1.6
NEW_134
  Top 0.203: JP43.1 8.26,74.93 13.97,74.93 JP2.6
NEW_135
  Top 0.203: JP44.5 8.26,63.5 JP1.10
NEW_136
  Top 0.203: JP44.4 8.26,64.77 13.97,64.77 JP2.10
NEW_137
  Top 0.203: JP44.3 8.26,66.04 JP1.9
NEW_138
  Route15 0.203: JP44.2 11.75,66.67 12.38,67.31 13.97,67.31 JP2.9
NEW_139
  Top 0.203: JP44.1 8.26,67.31 13.97,67.31 JP2.8
NEW_140
  Top 0.203: JP45.5 8.26,55.88 JP1.13
NEW_141
  Top 0.203: JP45.4 8.26,58.42 JP1.12
NEW_142
  Top 0.203: JP45.3 8.26,59.69 13.97,59.69 JP2.12
NEW_143
  Top 0.203: JP45.2 8.26,60.96 JP1.11
NEW_144
  Top 0.203: JP45.1 8.26,62.23 13.97,62.23 JP2.11
NEW_145
  Top 0.203: JP46.5 8.26,50.8 JP1.15
NEW_146
  Top 0.203: JP46.4 8.26,52.07 13.97,52.07 JP2.15
NEW_147
  Top 0.203: JP46.3 8.26,53.34 JP1.14
NEW_148  (via drill 0.3 layers 15-16)
  Route15 0.203: v9.84,53.98 JP46.2
  Bottom 0.203: v9.84,53.98 11.75,52.07 15.24,52.07 JP2.14
NEW_149
  Top 0.203: JP46.1 8.26,54.61 13.97,54.61 JP2.13
NEW_150
  Top 0.203: JP47.5 8.26,40.64 JP11.3
NEW_151
  Top 0.203: JP47.4 8.26,43.18 JP11.2
NEW_152
  Top 0.203: JP47.3 8.26,44.45 13.34,44.45 14.61,43.18 JP12.2
NEW_153
  Top 0.203: JP47.2 8.26,45.72 JP11.1
NEW_154
  Route15 0.203: JP47.1 11.75,46.35 12.38,46.99 13.97,46.99 JP12.1
NEW_155
  Top 0.203: JP48.5 8.26,35.56 JP11.5
NEW_156
  Top 0.203: JP48.4 8.26,36.83 13.97,36.83 JP12.5
NEW_157
  Top 0.203: JP48.3 8.26,38.1 JP11.4
NEW_158
  Route15 0.203: JP48.2 11.75,38.73 12.38,39.37 13.97,39.37 JP12.4
NEW_159
  Top 0.203: JP48.1 8.26,39.37 13.97,39.37 JP12.3
NEW_160
  Top 0.203: JP49.5 8.26,27.94 JP11.8
NEW_161
  Top 0.203: JP49.4 8.26,30.48 JP11.7
NEW_162
  Top 0.203: JP49.3 8.26,31.75 13.97,31.75 JP12.7
NEW_163
  Top 0.203: JP49.2 8.26,33.02 JP11.6
NEW_164
  Top 0.203: JP49.1 8.26,34.29 13.97,34.29 JP12.6
NEW_165
  Top 0.203: JP50.5 8.26,22.86 JP11.10
NEW_166
  Top 0.203: JP50.4 8.26,24.13 13.97,24.13 JP12.10
NEW_167
  Top 0.203: JP50.3 8.26,25.4 JP11.9
NEW_168
  Route15 0.203: JP50.2 11.75,26.04 12.38,26.67 13.97,26.67 JP12.9
NEW_169
  Top 0.203: JP50.1 8.26,26.67 13.97,26.67 JP12.8
NEW_170
  Top 0.203: JP51.5 8.26,15.24 JP11.13
NEW_171
  Top 0.203: JP51.4 8.26,17.78 JP11.12
NEW_172
  Top 0.203: JP51.3 8.26,19.05 13.97,19.05 JP12.12
NEW_173
  Top 0.203: JP51.2 8.26,20.32 JP11.11
NEW_174
  Top 0.203: JP51.1 8.26,21.59 13.97,21.59 JP12.11
NEW_175
  Top 0.203: JP52.5 8.26,10.16 JP11.15
NEW_176
  Top 0.203: JP52.4 8.26,11.43 13.97,11.43 JP12.15
NEW_177
  Top 0.203: JP52.3 8.26,12.7 JP11.14
NEW_178
  Top 0.203: JP52.2 8.26,13.97 13.97,13.97 JP12.14
NEW_179  (via drill 0.3)
  Top 0.203: v11.11,14.61 JP52.1
  Route15 0.203: v11.11,14.61 11.75,14.61 12.38,13.97 13.97,13.97 JP12.13
NEW_180  (via drill 0.3 layers 1-2)
  Top 0.203: JP53.5 4.13,83.5 v4.13,87.31
  Route2 0.203: v4.13,87.31 7.3,90.49 15.24,90.49 19.05,86.68 19.05,82.55 JP3.3
NEW_181
  Route2 0.203: JP53.4 4.76,84.14 4.76,87.31 7.3,89.85 14.29,89.85 16.51,87.63 16.51,85.09 JP3.2
NEW_182
  Top 0.203: JP53.3 6.67,85.41 6.67,87.95 9.21,87.95 12.06,85.09 19.05,85.09 JP4.2
NEW_183  (via drill 0.3)
  Top 0.203: JP53.2 4.76,86.68 4.76,88.58 10.48,88.58 10.79,88.27 v14.92,88.27
  Bottom 0.203: v14.92,88.27 17.78,88.27 JP3.1
NEW_184
  Route15 0.203: JP53.1 5.71,88.27 6.99,89.53 15.24,89.53 17.14,87.63 19.05,87.63 JP4.1
NEW_185  (via drill 0.3)
  Top 0.203: JP54.5 1.59,71.44 1.59,48.26 v18.41,48.26
  Bottom 0.203: v18.41,48.26 19.05,48.9 19.05,74.93 JP3.5
NEW_186  (via drill 0.3 layers 15-16)
  Route15 0.203: JP54.4 4.76,77.79 4.76,87.95 6.99,90.17 v11.11,90.17 | v11.11,76.2 12.38,74.93 19.05,74.93 JP4.5
  Bottom 0.203: v11.11,76.2 v11.11,90.17
NEW_187
  Route2 0.203: JP54.3 6.67,79.06 6.67,87.31 7.3,87.95 7.94,87.95 11.43,84.45 11.43,80.96 12.38,80.01 16.51,80.01 JP3.4
NEW_188  (via drill 0.3)
  Top 0.203: v4.13,80.96 JP54.2 | v25.08,85.09 25.08,80.01 21.59,80.01 JP4.4
  Bottom 0.203: v4.13,80.96 4.13,94.3 7.3,97.47 24.45,97.47 24.45,87.31 25.08,86.68 v25.08,85.09
NEW_189  (via drill 0.3, 0.3 layers 1-2, 0.3 layers 2-15)
  Top 0.203: v3.17,83.19 JP54.1 | v3.17,89.85 10.16,89.85 v11.11,88.9
  Route2 0.203: v11.11,88.9 11.75,88.27 13.97,88.27 14.61,87.63 v15.56,87.63
  Route15 0.203: v15.56,87.63 16.51,86.68 16.51,83.5 17.46,82.55 19.05,82.55 JP4.3
  Bottom 0.203: v3.17,89.85 v3.17,83.19
NEW_190  (via drill 0.3)
  Top 0.203: v9.53,91.76 v2.54,91.76
  Bottom 0.203: JP55.5 2.54,72.39 v2.54,91.76 | v9.53,91.76 10.48,90.81 10.48,71.44 12.06,69.85 13.97,69.85 13.97,67.94 14.61,67.31 17.78,67.31 JP3.8
NEW_191  (via drill 0.3, 0.3 layers 15-16)
  Top 0.203: v9.21,70.48 9.84,69.85 15.88,69.85 17.14,71.12 JP3.7
  Route15 0.203: v3.49,82.23 4.13,82.87 4.13,87.95 6.99,90.81 v8.57,90.81
  Bottom 0.203: JP55.4 3.49,72.71 v3.49,82.23 | v8.57,90.81 9.21,90.17 v9.21,70.48
NEW_192
  Route2 0.203: JP55.3 4.76,72.71 4.76,83.5 3.49,84.77 3.49,88.58 9.84,94.93 23.18,94.93 27.62,90.49 27.62,78.11 24.13,74.61 24.13,73.34 23.18,72.39 21.59,72.39 JP4.7
NEW_193  (via drill 0.3, 0.3 layers 15-16)
  Route2 0.203: v9.84,77.47 12.38,74.93 16.51,74.93 JP3.6
  Route15 0.203: JP55.2 2.54,76.2 2.54,87 7.3,91.76 v8.57,91.76
  Bottom 0.203: v8.57,91.76 9.84,90.49 v9.84,77.47
NEW_194  (via drill 0.3, 0.3 layers 1-2)
  Top 0.203: v4.76,93.98 6.99,96.2 v25.08,96.2 | v25.08,92.08 26.99,90.17 v26.99,85.72
  Route2 0.203: v26.99,85.72 26.99,78.74 23.18,74.93 21.59,74.93 JP4.6
  Bottom 0.203: JP55.1 4.76,75.25 v4.76,93.98 | v25.08,92.08 v25.08,96.2
NEW_195  (via drill 0.3 layers 1-2)
  Top 0.203: JP56.5 6.67,61.91 v6.67,49.53
  Route2 0.203: v6.67,49.53 6.99,49.53 7.3,49.21 7.94,49.21 11.43,52.7 11.43,61.28 12.38,62.23 16.51,62.23 JP3.10
NEW_196
  Route15 0.203: JP56.4 0.64,59.05 0.64,9.53 7.94,2.22 22.54,2.22 26.35,6.03 26.35,36.2 24.13,38.42 24.13,43.81 24.77,44.45 24.77,63.18 23.18,64.77 21.59,64.77 JP4.10
NEW_197  (via drill 0.3 layers 1-2)
  Top 0.203: JP56.3 2.22,61.91 2.22,48.9 15.24,48.9 16.51,50.16 v16.51,52.39
  Route2 0.203: v16.51,52.39 16.51,53.66 17.46,54.61 18.1,54.61 19.05,55.56 19.05,64.77 JP3.9
NEW_198  (via drill 0.3)
  Route2 0.203: v23.81,96.84 23.81,96.52 28.89,91.44 28.89,78.11 25.4,74.61 25.4,69.53 23.18,67.31 21.59,67.31 JP4.9
  Bottom 0.203: JP56.2 6.67,67.63 6.67,94.3 9.21,96.84 v23.81,96.84
NEW_199
  Route2 0.203: JP56.1 2.22,71.44 2.22,82.55 1.59,83.19 1.59,87.31 9.84,95.57 23.18,95.57 28.26,90.49 28.26,78.11 24.77,74.61 24.77,71.44 23.18,69.85 21.59,69.85 JP4.8
NEW_200
  Bottom 0.203: JP57.5 6.67,55.56 6.67,49.85 7.3,49.21 8.57,49.21 8.57,56.83 8.89,57.15 11.43,57.15 11.43,55.24 12.06,54.61 17.78,54.61 JP3.13
NEW_201  (via drill 0.3, 0.3 layers 15-16)
  Top 0.203: v9.21,56.52 9.84,57.15 15.88,57.15 17.14,58.42 JP3.12
  Route15 0.203: JP57.4 2.86,54.93 2.86,50.8 5.08,48.58 v6.35,48.58
  Bottom 0.203: v6.35,48.58 9.21,48.58 v9.21,56.52
NEW_202  (via drill 0.3)
  Route2 0.203: JP57.3 2.22,55.56 2.22,49.53 3.81,47.94 5.08,47.94 5.71,47.31 7.94,47.31 10.79,44.45 v16.83,44.45
  Bottom 0.203: v16.83,44.45 21.59,44.45 21.59,57.15 JP4.12
NEW_203
  Route15 0.203: JP57.2 6.67,59.37 6.67,58.74 6.35,58.42 6.67,58.1 6.67,57.47 6.35,57.15 6.67,56.83 6.67,49.85 7.3,49.21 7.94,49.21 11.43,52.7 11.43,58.74 12.38,59.69 16.51,59.69 JP3.11
NEW_204  (via drill 0.3, 0.3 layers 1-2)
  Top 0.203: v26.67,60.33 23.5,57.15 19.68,57.15 19.05,57.78 19.05,60.96 JP4.11
  Route2 0.203: v26.67,95.57 26.67,94.3 29.53,91.44 29.53,77.47 28.26,76.2 28.26,69.85 26.67,68.26 v26.67,60.33
  Bottom 0.203: JP57.1 1.91,65.41 1.91,93.03 6.99,98.11 26.67,98.11 v26.67,95.57
NEW_205  (via drill 0.3)
  Top 0.203: JP58.5 5.4,49.85 v2.86,49.85 | v9.21,7.3 v1.27,7.3
  Bottom 0.203: v2.86,49.85 1.27,48.26 v1.27,7.3 | v9.21,7.3 9.84,7.94 9.84,44.77 12.38,47.31 17.78,47.31 JP3.15
NEW_206  (via drill 0.3)
  Top 0.203: v16.51,49.21 16.83,49.53 19.05,49.53 JP4.15
  Bottom 0.203: JP58.4 4.76,50.48 4.76,49.21 6.03,47.94 16.51,47.94 v16.51,49.21
NEW_207  (via drill 0.3, 0.3 layers 15-16)
  Top 0.203: v3.81,54.61 JP58.3 | v26.35,59.05 26.35,55.24 25.08,55.24 24.13,54.29 24.13,52.07 19.05,52.07 JP3.14
  Route15 0.203: v1.27,86.36 9.21,94.3 v25.72,94.3
  Bottom 0.203: v3.81,54.61 1.27,57.15 v1.27,86.36 | v25.72,94.3 25.72,89.53 26.35,88.9 v26.35,59.05
NEW_208
  Route2 0.203: JP58.2 4.45,52.7 4.45,49.21 5.71,47.94 16.51,47.94 19.05,50.48 19.05,52.07 JP4.14
NEW_209  (via drill 0.3 layers 15-16)
  Route15 0.203: v5.08,47.94 7.3,47.94 11.43,52.07 18.1,52.07 19.05,53.02 19.05,54.61 JP4.13
  Bottom 0.203: JP58.1 4.13,53.66 4.13,48.9 v5.08,47.94
NEW_210  (via drill 0.3)
  Top 0.203: JP59.5 4.13,39.69 v3.81,39.69 | v3.17,5.4 11.11,5.4 12.38,6.67 19.37,6.67 21.59,8.89 23.5,8.89 24.13,9.53 24.13,21.59 22.23,21.59 21.59,22.23 21.59,23.5 22.23,24.13 23.5,24.13 24.13,24.77 24.13,26.67 17.14,26.67 16.51,27.3 16.51,29.21 v14.29,29.21
  Bottom 0.203: v3.81,39.69 3.17,39.05 v3.17,5.4 | v14.29,29.21 13.97,29.53 13.97,36.2 14.61,36.83 15.88,36.83 16.51,37.47 16.51,39.37 JP13.3
NEW_211  (via drill 0.3)
  Top 0.203: JP59.4 4.45,41.27 v4.13,41.27 | v10.48,6.03 v2.54,6.03
  Bottom 0.203: v4.13,41.27 2.54,39.69 v2.54,6.03 | v10.48,6.03 10.48,40.32 12.06,41.91 17.78,41.91 JP13.2
NEW_212  (via drill 0.3 layers 1-2)
  Top 0.203: JP59.3 5.08,43.18 3.81,43.18 1.91,45.09 1.91,47.62 0.95,47.62 0.64,47.31 v0.64,8.57 | v1.27,6.03 2.86,4.45 6.99,4.45 7.3,4.13 23.81,4.13 26.67,6.99 26.67,39.37 22.23,39.37 21.59,40.01 21.59,43.18 JP14.2
  Route2 0.203: v0.64,8.57 0.64,6.67 v1.27,6.03
NEW_213  (via drill 0.3)
  Top 0.203: JP59.2 4.45,43.81 v4.13,43.81 | v7.62,6.67 v1.91,6.67 | v9.21,46.99 9.84,47.62 15.88,47.62 JP13.1
  Bottom 0.203: v4.13,43.81 1.91,41.59 v1.91,6.67 | v7.62,6.67 9.21,8.26 v9.21,46.99
NEW_214  (via drill 0.3, 0.3 layers 15-16, 0.3 layers 2-15)
  Top 0.203: JP59.1 4.76,47.31 v4.45,47.31
  Route2 0.203: v5.4,49.21 6.03,48.58 v13.65,48.58
  Route15 0.203: v5.4,49.21 v3.49,51.12 | v13.65,48.58 17.14,48.58 20,45.72 JP14.1
  Bottom 0.203: v4.45,47.31 3.49,48.26 v3.49,51.12
NEW_215  (via drill 0.3)
  Top 0.203: v25.72,33.66 25.08,34.29 19.05,34.29 JP13.5
  Bottom 0.203: JP60.5 4.45,33.66 4.45,3.49 5.71,2.22 25.72,2.22 v25.72,33.66
NEW_216
  Top 0.203: JP60.4 6.67,37.15 6.67,47.31 7.94,47.31 8.89,46.35 11.43,46.35 12.06,46.99 13.34,46.99 13.97,46.35 13.97,44.45 15.88,44.45 16.51,43.81 16.51,36.83 19.05,36.83 JP14.5
NEW_217  (via drill 0.3)
  Top 0.203: JP60.3 5.08,36.83 v4.13,36.83 | v25.72,34.61 23.5,36.83 19.68,36.83 18.41,38.1 JP13.4
  Bottom 0.203: v4.13,36.83 3.81,36.51 3.81,3.49 5.71,1.59 26.35,1.59 26.35,33.97 v25.72,34.61
NEW_218  (via drill 0.3, 0.3 layers 15-16)
  Top 0.203: v0.64,2.86 1.91,1.59 v26.99,1.59
  Route15 0.203: JP60.2 1.27,43.18 v1.27,49.21 | v24.77,36.51 23.5,36.51 23.18,36.83 21.59,36.83 JP14.4
  Bottom 0.203: v1.27,49.21 0.64,48.58 v0.64,2.86 | v26.99,1.59 26.99,34.29 v24.77,36.51
NEW_219  (via drill 0.3 layers 1-2)
  Top 0.203: v4.45,38.73 1.27,35.56 1.27,7.94 0.95,7.94 0.64,7.62 0.64,3.49 4.45,3.49 4.76,3.17 23.81,3.17 v26.35,5.71
  Route2 0.203: v4.45,38.73 JP60.1 | v26.35,5.71 26.35,38.73 23.18,41.91 21.59,41.91 JP14.3
NEW_220
  Route2 0.203: JP61.5 3.17,26.04 3.17,10.79 6.03,7.94 8.57,7.94 10.48,9.84 10.48,17.14 12.38,19.05 15.56,19.05 16.51,20 16.51,20.64 17.46,21.59 18.1,21.59 19.05,22.54 19.05,26.67 JP13.8
NEW_221  (via drill 0.3)
  Route2 0.203: JP61.4 2.54,26.67 2.54,8.57 6.35,4.76 v7.62,4.76
  Bottom 0.203: v7.62,4.76 7.62,3.81 7.94,3.49 24.45,3.49 24.45,30.8 23.5,31.75 17.78,31.75 JP13.7
NEW_222  (via drill 0.3 layers 1-2, 0.3 layers 2-15)
  Top 0.203: v25.4,8.57 25.4,29.21 21.59,29.21 JP14.7
  Route2 0.203: v1.59,41.91 1.59,79.38 0.95,80.01 0.95,89.22 11.11,99.38 35.24,99.38 36.51,98.11 48.9,98.11 55.56,91.44 55.56,25.72 57.78,23.5 57.78,8.57 50.16,0.95 30.16,0.95 25.4,5.71 v25.4,8.57
  Route15 0.203: JP61.3 1.59,35.24 v1.59,41.91
NEW_223  (via drill 0.3)
  Route2 0.203: JP61.2 1.91,28.57 1.91,7.62 5.08,4.45 v5.08,3.81
  Bottom 0.203: v5.08,3.81 6.99,3.81 7.94,2.86 25.08,2.86 25.08,32.7 23.5,34.29 17.78,34.29 JP13.6
NEW_224  (via drill 0.3 layers 1-2)
  Top 0.203: v0.95,48.26 0.95,89.22 v8.26,89.22
  Route2 0.203: JP61.1 0.95,38.42 v0.95,48.26 | v8.26,89.22 12.38,85.09 15.56,85.09 16.51,84.14 16.51,80.96 17.46,80.01 18.1,80.01 19.05,79.06 19.05,65.72 20,64.77 23.18,64.77 24.13,63.82 24.13,48.58 21.59,46.04 21.59,42.86 20.64,41.91 17.46,41.91 16.51,40.96 16.51,35.24 17.46,34.29 19.05,34.29 JP14.6
NEW_225  (via drill 0.3 layers 1-2)
  Top 0.203: JP62.5 6.67,21.27 6.67,8.57 8.26,8.57 v9.21,9.53
  Route2 0.203: v9.21,9.53 9.21,18.41 12.38,21.59 16.51,21.59 JP13.10
NEW_226  (via drill 0.3, 0.3 layers 1-2, 0.3 layers 15-16)
  Top 0.203: v4.76,33.02 v4.76,26.67 | v1.27,36.51 1.27,43.81 v2.22,43.81 | v53.02,98.74 57.47,94.3 57.47,24.45 v55.24,24.45
  Route2 0.203: JP62.4 4.45,23.5 4.13,23.81 4.13,26.04 v4.76,26.67 | v1.27,36.51 v4.76,33.02
  Route15 0.203: v2.22,50.48 v2.22,43.81 | v30.16,99.38 35.24,99.38 35.88,98.74 v53.02,98.74 | v55.24,24.45 55.24,20 56.83,18.41 56.83,6.67 51.12,0.95 30.8,0.95 27.62,4.13 27.62,35.88 v24.77,38.73
  Bottom 0.203: v2.22,50.48 0.64,52.07 0.64,93.98 6.03,99.38 v30.16,99.38 | v24.77,38.73 24.13,38.1 24.13,37.47 23.5,36.83 16.51,36.83 16.51,27.3 17.14,26.67 19.05,26.67 19.05,24.13 JP14.10
NEW_227  (via drill 0.3 layers 15-16)
  Route15 0.203: JP62.3 4.13,23.18 4.13,9.21 5.4,7.94 v11.75,7.94
  Bottom 0.203: v11.75,7.94 13.97,7.94 13.97,23.5 14.61,24.13 17.78,24.13 JP13.9
NEW_228  (via drill 0.3 layers 2-15)
  Route2 0.203: JP62.2 6.67,25.08 6.67,9.21 7.3,8.57 7.94,8.57 8.57,9.21 v8.57,15.24
  Route15 0.203: v8.57,15.24 12.38,19.05 15.56,19.05 16.51,20 16.51,23.18 17.46,24.13 19.05,24.13 JP14.9
NEW_229
  Route15 0.203: JP62.1 1.59,23.18 1.59,9.21 7.94,2.86 22.54,2.86 25.4,5.71 25.4,24.45 23.18,26.67 21.59,26.67 JP14.8
NEW_230  (via drill 0.3 layers 2-15)
  Route2 0.203: v11.43,13.02 12.38,13.97 16.51,13.97 JP13.13
  Route15 0.203: JP63.5 4.76,14.92 4.76,9.21 5.4,8.57 7.94,8.57 10.79,11.43 10.79,12.38 v11.43,13.02
NEW_231  (via drill 0.3 layers 15-16)
  Route15 0.203: v8.57,12.7 10.48,14.61 10.48,14.92 12.06,16.51 16.51,16.51 JP13.12
  Bottom 0.203: JP63.4 6.67,16.19 6.67,9.21 7.3,8.57 8.57,8.57 v8.57,12.7
NEW_232  (via drill 0.3, 0.3 layers 1-2, 0.3 layers 15-16, 0.3 layers 2-15)
  Top 0.203: JP63.3 4.76,19.37 v4.76,24.13 | v11.11,8.57 11.43,8.89 18.41,8.89 19.05,9.53 19.05,13.97 20.95,13.97 21.59,14.61 21.59,17.78 JP14.12
  Route2 0.203: v4.76,24.77 v4.76,24.13
  Route15 0.203: v4.76,24.77 3.49,23.5 3.49,7.94 7.3,4.13 v8.26,4.13
  Bottom 0.203: v8.26,4.13 11.11,4.13 v11.11,8.57
NEW_233  (via drill 0.3 layers 1-2)
  Top 0.203: v3.81,15.56 3.81,10.79 3.49,10.48 3.49,7.94 v4.13,7.94
  Route2 0.203: JP63.2 3.81,17.78 v3.81,15.56 | v4.13,7.94 6.67,5.4 11.11,5.4 13.97,8.26 17.46,8.26 19.05,9.84 19.05,19.05 JP13.11
NEW_234  (1 unrouted)
NEW_235  (via drill 0.3 layers 15-16)
  Route15 0.203: v10.48,5.08 14.29,8.89 19.05,8.89 JP14.15
  Bottom 0.203: JP64.5 6.99,8.26 6.99,6.35 8.26,5.08 v10.48,5.08
NEW_236  (via drill 0.3 layers 1-2)
  Top 0.203: JP64.3 4.13,10.48 v4.13,8.89
  Route2 0.203: v4.13,8.89 6.99,6.03 9.53,6.03 12.38,8.89 15.56,8.89 16.51,9.84 16.51,11.43 JP13.14
NEW_237
  Route15 0.203: JP64.2 6.67,14.29 6.67,46.67 7.62,47.62 17.46,47.62 19.05,46.04 19.05,27.62 20,26.67 20.64,26.67 21.59,25.72 21.59,13.97 JP14.14
NEW_238  (via drill 0.3)
  Top 0.203: JP64.1 4.13,16.19 4.13,35.88 v4.45,35.88 | v8.57,16.51 19.05,16.51 JP14.13
  Bottom 0.203: v4.45,35.88 4.76,36.2 4.76,46.67 5.4,47.31 8.57,47.31 v8.57,16.51
NEW_239
  Route2 0.203: JP89.5 21.59,87 21.59,77.47 JP5.5
NEW_240  (via drill 0.3)
  Top 0.203: JP89.4 17.14,90.17 22.23,90.17 22.86,89.53 v25.08,89.53 | JP5.4 v25.72,78.74
  Bottom 0.203: v25.08,89.53 25.72,88.9 v25.72,78.74
NEW_241
  Route15 0.203: JP89.3 14.61,90.81 17.14,88.27 20,88.27 21.59,86.68 21.59,82.55 JP5.3
NEW_242  (via drill 0.3 layers 15-16)
  Route15 0.203: v16.19,90.17 19.05,90.17 21.59,87.63 23.18,87.63 24.13,86.68 24.13,85.09 JP5.2
  Bottom 0.203: JP89.2 14.61,90.17 v16.19,90.17
NEW_243  (via drill 0.3)
  Top 0.203: v22.86,88.9 v12.06,88.9
  Bottom 0.203: v12.06,88.9 JP89.1 | JP5.1 v22.86,88.9
NEW_244  (via drill 0.3 layers 1-2)
  Top 0.203: v25.08,78.11 25.08,63.5 JP5.10
  Route2 0.203: JP90.5 23.5,87.95 25.72,85.72 25.72,79.69 25.08,79.06 v25.08,78.11
NEW_245  (via drill 0.3 layers 1-2)
  Top 0.203: v24.13,77.79 24.13,66.04 JP5.9
  Route2 0.203: JP90.4 22.23,88.58 24.13,86.68 v24.13,77.79
NEW_246  (via drill 0.3)
  Top 0.203: v16.83,69.85 21.59,69.85 JP5.8
  Bottom 0.203: JP90.3 19.68,90.17 16.83,90.17 16.83,89.85 15.88,88.9 14.29,88.9 14.29,87.31 13.97,87 13.97,70.48 14.61,69.85 v16.83,69.85
NEW_247
  Route15 0.203: JP90.2 21.59,89.53 23.18,89.53 26.99,85.72 26.99,75.25 JP5.7
NEW_248
  Route15 0.203: JP90.1 21.59,88.27 23.18,88.27 25.72,85.72 25.72,79.69 24.13,78.11 24.13,74.93 JP5.6
NEW_249  (via drill 0.3 layers 1-2)
  Top 0.203: v22.86,94.3 23.81,94.3 27.62,90.49 v27.62,75.88 | v25.4,54.61 25.4,50.8 JP5.15
  Route2 0.203: JP91.5 18.1,94.3 v22.86,94.3 | v27.62,75.88 27.62,69.85 25.4,67.63 v25.4,54.61
NEW_250  (via drill 0.3, 0.3 layers 15-16)
  Top 0.203: v16.51,56.83 16.51,54.61 21.59,54.61 JP5.14
  Route15 0.203: v7.3,88.58 9.84,86.04 9.84,78.42 10.48,77.79 10.48,77.15 v9.84,76.52
  Bottom 0.203: JP91.4 14.92,94.3 7.3,94.3 v7.3,88.58 | v9.84,76.52 9.84,59.37 12.06,57.15 16.51,57.15 v16.51,56.83
NEW_251  (via drill 0.3 layers 15-16)
  Route15 0.203: v8.57,85.09 8.57,82.23 9.21,81.6 9.21,73.03 12.38,69.85 15.56,69.85 16.51,68.9 16.51,63.18 17.46,62.23 18.1,62.23 19.05,61.28 19.05,58.1 20,57.15 21.59,57.15 JP5.13
  Bottom 0.203: JP91.3 13.65,92.39 11.11,92.39 11.11,92.71 10.48,93.34 7.94,93.34 7.94,87.95 8.57,87.31 v8.57,85.09
NEW_252  (via drill 0.3, 0.3 layers 15-16)
  Top 0.203: v13.65,87.63 23.5,87.63 26.35,84.77 26.35,62.23 22.23,62.23 21.59,61.59 21.59,58.42 JP5.12
  Route15 0.203: JP91.2 12.38,92.39 11.75,92.39 11.11,91.76 11.11,91.12 12.06,90.17 v12.7,90.17
  Bottom 0.203: v12.7,90.17 13.65,89.22 v13.65,87.63
NEW_253  (via drill 0.3)
  Top 0.203: JP91.1 14.29,95.57 v25.72,95.57 | v26.35,89.85 26.35,85.41 26.99,84.77 26.99,60.96 JP5.11
  Bottom 0.203: v25.72,95.57 26.35,94.93 v26.35,89.85
NEW_254  (via drill 0.3 layers 15-16, 0.3 layers 2-15)
  Route2 0.203: JP92.5 23.5,92.71 24.45,91.76 24.45,87.63 26.35,85.72 v26.35,79.38
  Route15 0.203: v26.35,79.38 26.35,78.42 v25.72,77.79
  Bottom 0.203: v25.72,77.79 25.4,77.47 25.4,38.1 JP15.5
NEW_255  (via drill 0.3 layers 15-16)
  Route15 0.203: JP92.4 23.18,92.39 23.81,92.39 24.45,91.76 24.45,90.81 v23.81,90.17
  Bottom 0.203: v23.81,90.17 23.81,87.31 24.45,86.68 24.45,75.25 24.77,74.93 24.77,40.01 JP15.4
NEW_256  (via drill 0.3, 0.3 layers 1-2)
  Top 0.203: JP92.3 22.54,94.93 26.04,94.93 27.3,93.66 29.53,93.66 v31.43,95.57 | v28.57,44.45 24.77,40.64 JP15.3
  Route2 0.203: v31.43,95.57 32.07,96.2 43.18,96.2 v46.99,92.39
  Bottom 0.203: v46.99,92.39 46.67,92.08 46.67,67.63 43.81,64.77 41.91,64.77 41.91,50.16 38.73,46.99 34.92,46.99 34.29,46.35 34.29,45.09 33.66,44.45 v28.57,44.45
NEW_257  (via drill 0.3, 0.3 layers 15-16)
  Top 0.203: JP92.2 20.64,92.39 23.81,92.39 24.45,91.76 24.45,90.49 v22.86,90.49
  Route15 0.203: v21.59,77.15 21.59,70.8 20.64,69.85 20,69.85 19.05,68.9 19.05,63.18 20,62.23 23.18,62.23 24.13,61.28 24.13,44.45 JP15.2
  Bottom 0.203: v22.86,90.49 21.59,89.22 v21.59,77.15
NEW_258  (via drill 0.3)
  Top 0.203: JP92.1 17.46,92.39 11.75,92.39 11.11,91.76 11.11,89.53 v17.46,89.53
  Bottom 0.203: v17.46,89.53 19.05,87.95 19.05,75.56 19.68,74.93 24.13,74.93 24.13,46.99 JP15.1
NEW_259
  Route15 0.203: JP97.5 18.1,6.03 20.95,6.03 24.77,9.84 24.77,18.41 JP15.11
NEW_260  (via drill 0.3)
  Top 0.203: v16.51,18.73 16.83,19.05 21.59,19.05 JP15.12
  Bottom 0.203: JP97.4 16.51,5.71 v16.51,18.73
NEW_261
  Route15 0.203: JP97.3 16.19,6.67 20.95,6.67 24.13,9.84 24.13,13.97 JP15.13
NEW_262
  Route15 0.203: JP97.2 15.56,7.3 19.05,7.3 21.59,9.84 21.59,11.43 JP15.14
NEW_263  (via drill 0.3)
  Top 0.203: v13.97,7.3 19.37,7.3 22.23,10.16 JP15.15
  Bottom 0.203: JP97.1 13.97,6.99 v13.97,7.3
NEW_264
  Top 0.203: JP98.5 26.04,7.62 26.04,33.02 JP15.6
NEW_265
  Bottom 0.203: JP98.4 21.59,5.71 21.59,29.21 JP15.7
NEW_266
  Route2 0.203: JP98.3 20.95,6.99 21.59,7.62 21.59,26.67 JP15.8
NEW_267  (via drill 0.3)
  Top 0.203: v19.05,21.27 19.05,24.13 21.59,24.13 JP15.9
  Bottom 0.203: JP98.2 19.05,5.71 v19.05,21.27
NEW_268
  Top 0.203: JP98.1 20,6.67 21.91,6.67 24.77,9.53 24.77,22.86 JP15.10
NEW_269  (via drill 0.3)
  Route2 0.203: JP93.5 36.51,94.3 32.07,94.3 30.8,93.03 30.8,90.81 33.02,88.58 33.02,87.95 31.75,86.68 31.75,78.42 32.7,77.47 v36.51,77.47
  Bottom 0.203: v36.51,77.47 34.29,77.47 34.29,46.99 JP16.1
NEW_270  (via drill 0.3, 0.3 layers 2-15)
  Route2 0.203: v34.92,94.93 32.07,94.93 30.16,93.03 v30.16,91.76
  Route15 0.203: v30.16,91.76 28.26,89.85 28.26,72.71 31.75,69.22 31.75,63.18 32.7,62.23 33.34,62.23 34.29,61.28 34.29,44.45 JP16.2
  Bottom 0.203: JP93.4 34.92,94.61 v34.92,94.93
NEW_271  (via drill 0.3, 0.3 layers 15-16)
  Top 0.203: v28.57,1.27 v57.78,1.27
  Route15 0.203: v35.88,95.57 37.15,95.57 39.05,97.47 v44.77,97.47
  Bottom 0.203: JP93.3 34.29,93.98 34.29,95.25 34.61,95.57 v35.88,95.57 | v44.77,97.47 57.78,97.47 v57.78,1.27 | v28.57,1.27 28.26,1.59 28.26,36.51 32.38,40.64 JP16.3
NEW_272  (via drill 0.3)
  Top 0.203: v42.55,88.9 41.27,87.63 34.92,87.63 34.29,87 34.29,72.39 31.11,72.39 28.26,69.53 27.94,69.53 27.62,69.22 27.62,59.69 33.66,59.69 34.29,59.05 34.29,41.91 32.38,41.91 31.11,40.64 31.11,38.1 JP16.4
  Route15 0.203: JP93.2 34.61,94.3 37.15,94.3 38.42,95.57 43.5,95.57 45.4,93.66 45.4,91.76 v42.55,88.9
NEW_273  (via drill 0.3, 0.3 layers 15-16, 0.3 layers 2-15)
  Route2 0.203: v40.64,94.93 42.23,94.93 42.86,94.3 44.13,94.3 45.4,93.03 v45.4,88.58 | v46.35,74.61 46.35,66.67 45.4,65.72 45.4,59.05 43.5,57.15 42.86,57.15 41.91,56.2 41.91,55.56 40.96,54.61 32.7,54.61 31.11,53.02 31.11,37.47 JP16.5
  Route15 0.203: JP93.1 36.83,97.79 v38.42,97.79 | v45.4,88.58 45.4,83.82 46.04,83.19 46.04,74.93 v46.35,74.61
  Bottom 0.203: v38.42,97.79 40.64,95.57 v40.64,94.93
NEW_274  (via drill 0.3 layers 2-15)
  Route2 0.203: JP94.5 43.81,92.71 44.77,91.76 44.77,91.12 43.18,89.53 40.32,89.53 38.42,87.63 37.78,87.63 36.83,86.68 36.83,86.04 35.88,85.09 v34.92,85.09 | JP6.11 v34.29,62.23
  Route15 0.203: v34.92,85.09 32.7,85.09 31.75,84.14 31.75,70.8 32.7,69.85 33.34,69.85 34.29,68.9 v34.29,62.23
NEW_275  (via drill 0.3)
  Top 0.203: v47.62,94.93 v43.18,94.93 | v56.2,18.1 56.2,8.57 v54.93,8.57 | v30.48,51.75 30.48,58.1 32.7,58.1 JP6.12
  Bottom 0.203: JP94.4 43.18,93.98 v43.18,94.93 | v47.62,94.93 56.2,86.36 v56.2,18.1 | v54.93,8.57 54.93,5.71 49.85,0.64 27.62,0.64 27.62,48.9 v30.48,51.75
NEW_276  (via drill 0.3 layers 2-15)
  Route2 0.203: JP94.3 39.05,95.57 v32.38,95.57
  Route15 0.203: v32.38,95.57 30.16,93.34 30.16,92.71 27.62,90.17 27.62,61.28 JP6.13
NEW_277  (via drill 0.3, 0.3 layers 15-16)
  Top 0.203: v53.66,96.84 51.44,99.06 29.53,99.06 v28.89,98.42
  Route15 0.203: v45.4,96.84 v43.5,96.84
  Bottom 0.203: v43.5,96.84 JP94.2 | v53.66,96.84 v45.4,96.84 | v28.89,98.42 27.3,96.84 27.3,93.98 26.99,93.66 26.99,58.1 30.8,54.29 30.8,53.98 31.43,53.34 JP6.14
NEW_278  (via drill 0.3, 0.3 layers 15-16)
  Top 0.203: v31.43,54.29 31.43,50.8 JP6.15
  Route15 0.203: v33.66,97.47 33.02,98.11 32.38,98.11 v27.62,93.34
  Bottom 0.203: JP94.1 38.73,94.61 35.88,97.47 v33.66,97.47 | v27.62,93.34 27.62,58.1 v31.43,54.29
NEW_279  (via drill 0.3 layers 1-2)
  Top 0.203: JP95.5 36.51,92.39 32.07,92.39 31.43,91.76 31.43,88.58 30.48,87.63 v30.16,87.63 | v30.16,85.72 30.16,74.3 32.38,74.3 JP6.6
  Route2 0.203: v30.16,85.72 v30.16,87.63
NEW_280  (via drill 0.3 layers 1-2)
  Top 0.203: v33.02,90.17 33.02,89.53 29.53,86.04 v29.53,76.52
  Route2 0.203: JP95.4 36.2,89.22 35.24,88.27 34.61,88.27 34.29,88.58 34.29,89.85 33.97,90.17 v33.02,90.17 | v29.53,76.52 29.53,74.3 32.7,71.12 JP6.7
NEW_281  (via drill 0.3 layers 1-2, 0.3 layers 2-15)
  Top 0.203: v34.92,88.9 33.02,88.9 31.11,87 v31.11,75.25
  Route2 0.203: v34.92,88.9 JP95.3 | v31.11,75.25 30.48,74.61 v30.48,74.3
  Route15 0.203: v30.48,74.3 30.48,71.12 JP6.8
NEW_282  (via drill 0.3)
  Top 0.203: JP95.2 34.92,90.17 v40.96,90.17
  Route2 0.203: v44.45,69.53 43.81,69.53 43.5,69.85 35.24,69.85 34.29,68.9 34.29,67.31 JP6.9
  Bottom 0.203: v40.96,90.17 41.91,89.22 41.91,70.48 42.55,69.85 44.45,69.85 v44.45,69.53
NEW_283  (via drill 0.3 layers 15-16, 0.3 layers 2-15)
  Route2 0.203: v31.11,71.44 31.11,65.41 JP6.10
  Route15 0.203: v32.07,87.63 32.07,87 31.11,86.04 v31.11,71.44
  Bottom 0.203: JP95.1 32.07,91.12 v32.07,87.63
NEW_284  (via drill 0.3)
  Top 0.203: JP96.5 41.91,89.53 v33.66,89.53
  Bottom 0.203: v33.66,89.53 33.02,88.9 JP6.1
NEW_285  (via drill 0.3 layers 15-16)
  Route15 0.203: JP96.4 41.59,90.49 41.59,89.85 41.27,89.53 38.42,89.53 v38.1,89.85
  Bottom 0.203: v38.1,89.85 34.29,89.85 34.29,85.09 JP6.2
NEW_286  (via drill 0.3)
  Top 0.203: v40.64,88.9 40.01,88.27 33.02,88.27 31.75,87 31.75,81.28 JP6.3
  Bottom 0.203: JP96.3 40.32,90.49 40.32,89.22 v40.64,88.9
NEW_287  (via drill 0.3 layers 2-15)
  Route2 0.203: v34.92,80.01 34.29,80.01 JP6.4
  Route15 0.203: JP96.2 39.05,90.49 37.78,90.49 37.47,90.17 37.47,88.58 39.37,86.68 39.37,86.04 40.32,85.09 43.5,85.09 45.09,83.5 45.09,79.06 43.5,77.47 37.78,77.47 36.83,78.42 36.83,79.06 35.88,80.01 v34.92,80.01
NEW_288
  Bottom 0.203: JP96.1 38.73,88.58 37.78,87.63 36.83,87.63 36.83,80.64 36.2,80.01 34.29,80.01 34.29,78.11 33.02,76.83 JP6.5
NEW_289
  Route2 0.203: JP99.5 33.66,8.89 32.7,8.89 31.75,9.84 31.75,21.59 JP16.10
NEW_290  (via drill 0.3 layers 1-2)
  Top 0.203: JP99.4 33.66,7.62 33.02,7.62 31.11,9.53 v31.11,20.64
  Route2 0.203: v31.11,20.64 30.16,21.59 30.16,22.54 JP16.9
NEW_291  (via drill 0.3)
  Top 0.203: JP99.3 30.48,9.53 v30.16,9.53 | v30.8,26.35 32.38,27.94 JP16.8
  Bottom 0.203: v30.16,9.53 30.16,25.72 v30.8,26.35
NEW_292
  Bottom 0.203: JP99.2 34.29,5.71 34.29,29.21 JP16.7
NEW_293
  Bottom 0.203: JP99.1 31.75,5.71 31.75,31.75 JP16.6
NEW_294
  Route2 0.203: JP100.5 40.64,8.26 34.92,8.26 JP16.15
NEW_295
  Route15 0.203: JP100.4 40.01,7.62 36.51,7.62 34.29,9.84 34.29,11.43 JP16.14
NEW_296
  Route15 0.203: JP100.3 39.05,2.86 32.7,2.86 30.8,4.76 30.8,13.02 JP16.13
NEW_297
  Top 0.203: JP100.2 36.2,8.89 34.92,8.89 34.29,9.53 34.29,17.78 JP16.12
NEW_298
  Top 0.203: JP100.1 35.56,8.26 33.02,8.26 31.75,9.53 31.75,20.32 JP16.11
NEW_300  (via drill 0.3)
  Top 0.203: JP64.4 4.76,9.84 4.76,7.94 v18.1,7.94
  Bottom 0.203: v18.1,7.94 17.78,8.26 JP13.15